# Altium schematic sheet Schematic_Tongue_CMU.SchDoc: Tongue_CMU
size A3; SheetNumber: 1; SheetTotal: 1